# EAGLE design Arduino I2C (EAGLE 6.5.0)
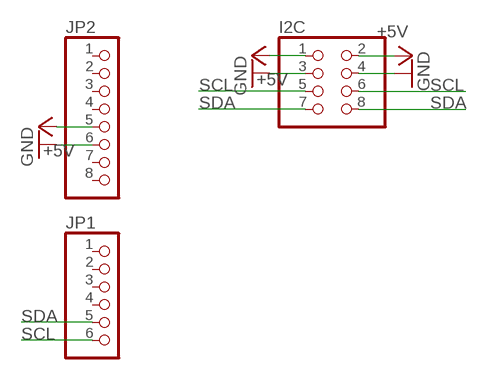
[diagram p0: schematic, sheet 1]

## Parts
I2C  PINHD-2X4  [2X04]
JP1  PINHD-1X6CLEAN  [1X06-CLEAN]
JP2  PINHD-1X8CLEANBIG  [1X08-CLEANBIG]

## Nets
+5V: I2C.1 I2C.2 JP2.5
GND: I2C.3 I2C.4 JP2.6
SCL: I2C.5 I2C.6 JP1.6
SDA: I2C.7 I2C.8 JP1.5
Unconnected: JP1.1 JP1.2 JP1.3 JP1.4 JP2.1 JP2.2 JP2.3 JP2.4 JP2.7 JP2.8

## Library data of the parts
I2C = adafruit:PINHD-2X4: PIN HEADER
JP1 = adafruit:PINHD-1X6: PIN HEADER
JP2 = adafruit:PINHD-1X8: PIN HEADER

## Board
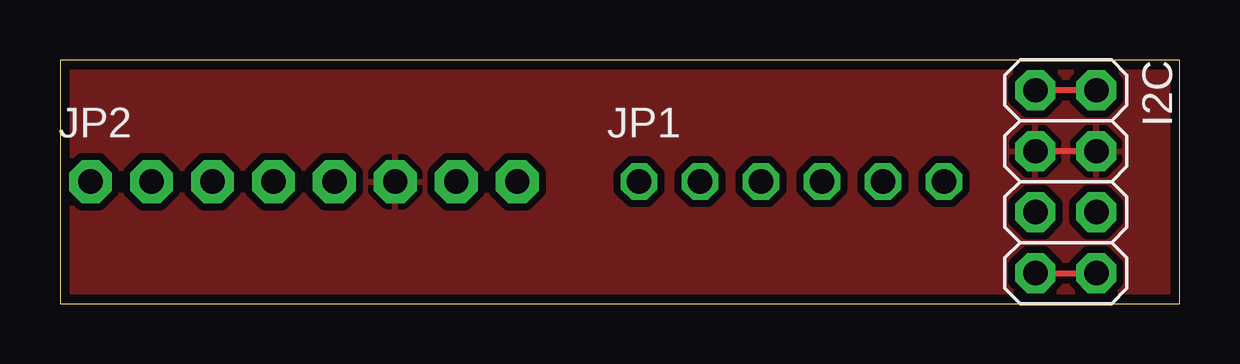
[diagram p1: board, top side]
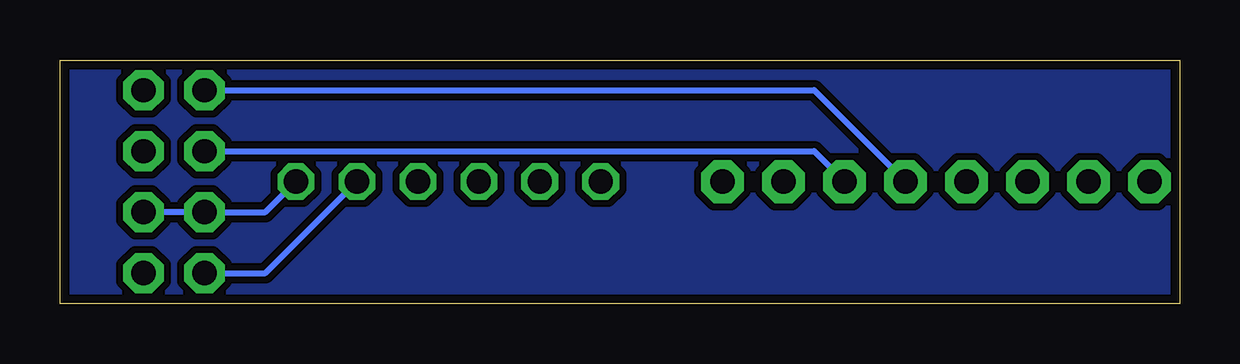
[diagram p2: board, bottom side, seen from below]

Size 46.66 x 10.15 mm. Coordinates in mm from the lower left corner, seen from the top.
Outline: 0,0 46.66,0 46.66,10.15 0,10.15 0,0
Copper layers (1*16): Top 0.0356mm / dielectric 1.5011mm / Bottom 0.0356mm
Design rules "LaenPCBOrder": minimum track width 6mil, minimum drill 13mil, track to track 6mil, track to pad 6mil, pad to pad 6mil, via to via 6mil, smd to smd 6mil, copper to edge 15mil, drill to drill 6mil, minimum pad ring 7mil, minimum via ring 7mil, stop-mask expansion 3mil, vias tented up to drill 0mil, thermal gap 10mil

### Footprints (pad centres in the part's own frame; a part is rotated, then mirrored left to right if it is on the bottom)
2X04 = drill 1.016 pad 1.676 octagon: 1 -3.81,-1.27; 2 -3.81,1.27; 3 -1.27,-1.27; 4 -1.27,1.27; 5 1.27,-1.27; 6 1.27,1.27; 7 3.81,-1.27; 8 3.81,1.27
1X06-CLEAN = drill 1.016 octagon: 1 -6.35,0; 2 -3.81,0; 3 -1.27,0; 4 1.27,0; 5 3.81,0; 6 6.35,0
1X08-CLEANBIG = drill 1.016 pad 1.778 octagon: 1 -8.89,0; 2 -6.35,0; 3 -3.81,0; 4 -1.27,0; 5 1.27,0; 6 3.81,0; 7 6.35,0; 8 8.89,0

### Placement (x,y rotation side)
I2C  41.91,5.08 270 top
JP1  30.48,5.08 0 top
JP2  10.16,5.08 0 top

### Tracks (layer width: path | path; a pad name or v marks a point on that pad's centre or on a via)
+5V
  Top 0.254: I2C.2 I2C.1
  Bottom 0.254: JP2.5 15.24,8.89 I2C.1
GND
  Top 0.254: I2C.4 I2C.3
  Bottom 0.254: JP2.6 15.24,6.35 I2C.3
  pour Top (isolate 0.305): 0,10.13 46.58,10.13 46.58,0 0,0
N$1
  pour Bottom (isolate 0.305): 0,10.13 46.58,10.13 46.58,0 0,0
SCL
  Bottom 0.254: JP1.6 38.1,3.81 I2C.5 I2C.6
SDA
  Top 0.254: I2C.7 I2C.8
  Bottom 0.254: JP1.5 38.1,1.27 I2C.7